# EAGLE design choochoo_v1_brd2 (EAGLE 7.7.0)
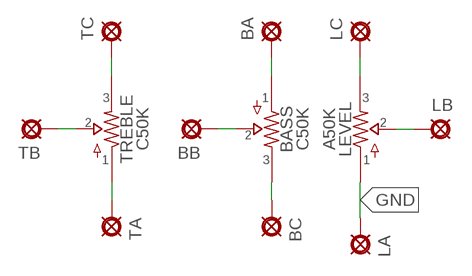
[diagram p0: schematic, sheet 1]

## Parts
BA  PAD8  [OCTOGON]
BASS  C50K  POTS9MM_MOUNTED_2MMH  [9MM_W/MOUNTS-2MMHOLES]
BB  PAD8  [OCTOGON]
BC  PAD8  [OCTOGON]
LA  PAD8  [OCTOGON]
LB  PAD8  [OCTOGON]
LC  PAD8  [OCTOGON]
LEVEL  A50K  POTS9MM_MOUNTED_2MMH  [9MM_W/MOUNTS-2MMHOLES]
TA  PAD8  [OCTOGON]
TB  PAD8  [OCTOGON]
TC  PAD8  [OCTOGON]
TREBLE  C50K  POTS9MM_MOUNTED_2MMH  [9MM_W/MOUNTS-2MMHOLES]

## Nets
GND: LA.1(PAD) LEVEL.P$1
N$21: TB.1(PAD) TREBLE.P$2
N$22: TC.1(PAD) TREBLE.P$3
N$23: TA.1(PAD) TREBLE.P$1
N$24: BASS.P$3 BC.1(PAD)
N$25: BASS.P$2 BB.1(PAD)
N$26: BA.1(PAD) BASS.P$1
N$28: LB.1(PAD) LEVEL.P$2
N$29: LC.1(PAD) LEVEL.P$3

## Library data of the parts
BA BB BC LA LB LC TA TB TC = kdd-supply:PAD: PAD use this package for pads with any purpose, including input, output, send or return various pad shapes: round, square, octogonal, long, and long offset
BASS LEVEL TREBLE = kdd-mb-pots:POTS

## Board
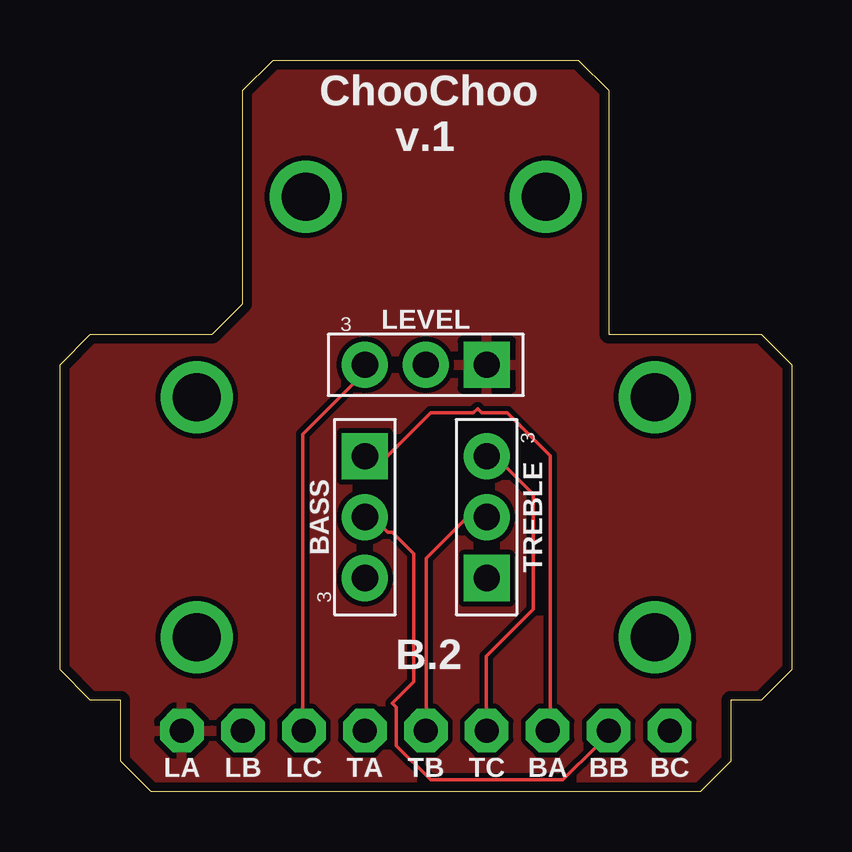
[diagram p1: board, top side]
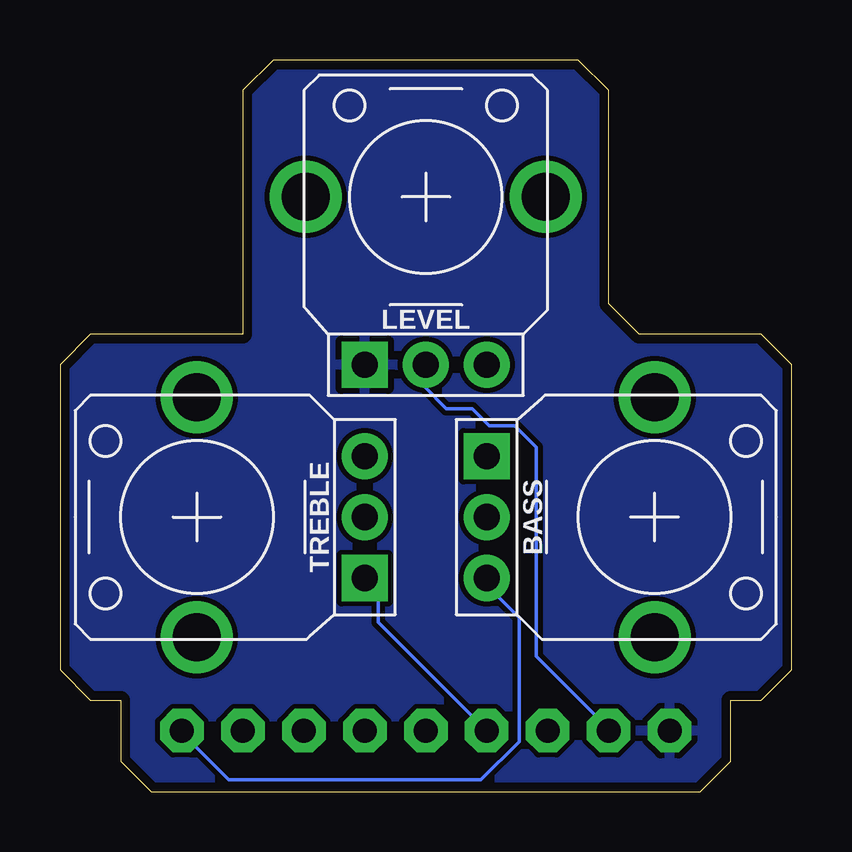
[diagram p2: board, bottom side, seen from below]

Size 30.48 x 30.48 mm. Coordinates in mm from the lower left corner, seen from the top.
Outline: 7.62,20.32 7.62,29.21 8.89,30.48 21.59,30.48 22.86,29.21 22.86,19.05 29.21,19.05 30.48,17.78 30.48,5.08 29.21,3.81 27.94,3.81 27.94,1.27 26.67,0 3.81,0 2.54,1.27 2.54,3.81 1.27,3.81 0,5.08 0,17.78 1.27,19.05 6.35,19.05 7.62,20.32
Copper layers (1*16): Top 0.0356mm / dielectric 1.5011mm / Bottom 0.0356mm
Design rules "Kyle-OSH": minimum track width 6mil, minimum drill 13mil, track to track 8mil, track to pad 8mil, pad to pad 8mil, via to via 8mil, smd to smd 6mil, copper to edge 15mil, drill to drill 6mil, minimum pad ring 16mil, minimum via ring 7mil, stop-mask expansion 3mil, vias tented up to drill 25mil, thermal gap 10mil

### Footprints (pad centres in the part's own frame; a part is rotated, then mirrored left to right if it is on the bottom)
OCTOGON = drill 1 octagon: 1 0,0
9MM_W/MOUNTS-2MMHOLES = drill 1.1 pad 1.93 square: P$1 2.54,0 | drill 1.1 pad 1.93: P$2 0,0; P$3 -2.54,0 | drill 2: P$4 -5,7; P$5 5,7

### Placement (x,y rotation side)
BA  20.32,2.54 0 top
BASS  12.7,11.43 90 top
BB  22.86,2.54 0 top
BC  25.4,2.54 0 top
LA  5.08,2.54 0 top
LB  7.62,2.54 0 top
LC  10.16,2.54 0 top
LEVEL  15.24,17.78 0 top
TA  12.7,2.54 0 top
TB  15.24,2.54 0 top
TC  17.78,2.54 0 top
TREBLE  17.78,11.43 270 top

### Tracks (layer width: path | path; a pad name or v marks a point on that pad's centre or on a via)
GND
  pour Bottom: 0,-1.27 31.75,-1.27 31.75,35.56 0,35.56
  pour Top: -1.27,36.83 33.02,36.83 33.02,-6.35 -1.27,-6.35
N$21
  Top 0.152: TB.1 15.27,2.62 15.27,9.73 16.87,11.33 17.75,11.33 TREBLE.P$2
N$22
  Top 0.152: TC.1 17.75,2.62 17.75,5.64 19.71,7.6 19.71,12.4 18.29,13.82 17.93,13.82 TREBLE.P$3
N$23
  Bottom 0.152: TA.1 17.22,7.06 17.22,8.31 17.75,8.84 TREBLE.P$1
N$24
  Bottom 0.152: BC.1 25.4,2.44 23.44,0.48 12.95,0.48 11.35,2.08 11.35,7.24 12.6,8.48 12.6,8.84 BASS.P$3
N$25
  Top 0.152: BB.1 22.73,2.44 22.38,2.08 22.38,1.91 20.96,0.48 15.44,0.48 14.02,1.91 14.02,3.51 13.84,3.68 14.73,4.57 14.73,9.91 13.84,10.79 13.67,10.79 13.13,11.33 12.78,11.33 BASS.P$2
N$26
  Top 0.152: BA.1 20.42,2.62 20.42,13.99 18.64,15.77 17.58,15.77 17.4,15.95 17.22,15.77 15.44,15.77 13.67,13.99 12.78,13.99 BASS.P$1
N$28
  Bottom 0.152: LB.1 7.62,2.62 10.64,5.64 10.64,14.35 11.53,15.24 12.6,15.24 13.31,15.95 14.38,15.95 15.27,16.84 15.27,17.73 LEVEL.P$2
N$29
  Top 0.152: LC.1 10.11,2.62 10.11,14.88 12.6,17.37 12.6,17.73 LEVEL.P$3

### Text on the board
tNames: ChooChoo | v.1 | B.2